# Altium schematic sheet mcu.SchDoc
size OrCAD B; DocumentNumber: 2; SheetNumber: 2; SheetTotal: 3
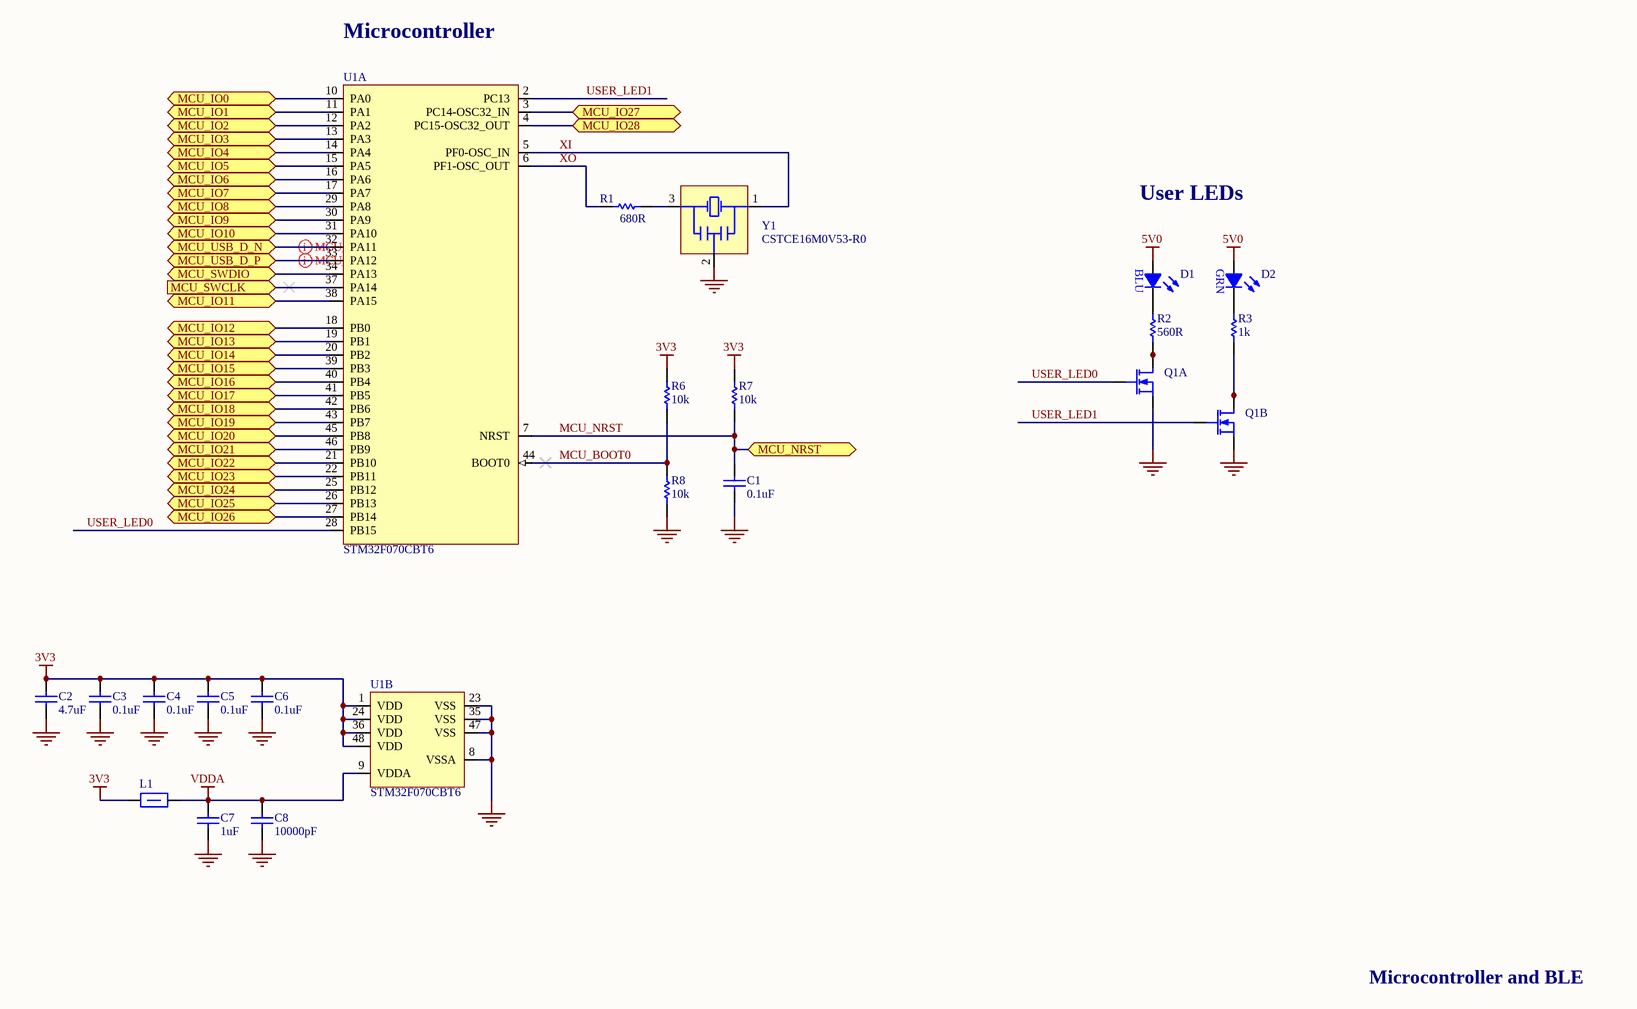
[diagram p0: mcu.SchDoc]

## Parts
C1  0.1uF  [C0201]
C2  4.7uF  [C0402]
C3  0.1uF  [C0201]
C4  0.1uF  [C0201]
C5  0.1uF  [C0201]
C6  0.1uF  [C0201]
C7  1uF  [C0402]
C8  10000pF  [C0201]
D1  5988091107F  [LED0603]  (value not drawn)
D2  5988070107F  [LED0603]  (value not drawn)
L1  BLM15AG601SN1D  [L0402]  (value not drawn)
Q1  PMDXB600UNE  [NXP_DFN1010B-6]  (value not drawn)  (parts A,B of 2)
R1  680R  [R0201]
R2  560R  [R0201]
R3  1k  [R0201]
R6  10k  [R0201]
R7  10k  [R0201]
R8  10k  [R0201]
U1  STM32F070CBT6  [STM_LQFP48]  (parts A,B of 2)
Y1  CSTCE16M0V53-R0  [MUR_CSTCE_V]

## Ports
MCU_IO0 (bidir), MCU_IO1 (bidir), MCU_IO2 (bidir), MCU_IO3 (bidir), MCU_IO4 (bidir), MCU_IO5 (bidir), MCU_IO6 (bidir), MCU_IO7 (bidir), MCU_IO8 (bidir), MCU_IO9 (bidir), MCU_IO10 (bidir), MCU_IO11 (bidir), MCU_IO12 (bidir), MCU_IO13 (bidir), MCU_IO14 (bidir), MCU_IO15 (bidir), MCU_IO16 (bidir), MCU_IO17 (bidir), MCU_IO18 (bidir), MCU_IO19 (bidir), MCU_IO20 (bidir), MCU_IO21 (bidir), MCU_IO22 (bidir), MCU_IO23 (bidir), MCU_IO24 (bidir), MCU_IO25 (bidir), MCU_IO26 (bidir), MCU_IO27 (bidir), MCU_IO28 (bidir), MCU_NRST (bidir), MCU_SWCLK (in), MCU_SWDIO (bidir), MCU_USB_D_N (bidir), MCU_USB_D_P (bidir)

## Nets
3V3: C2.2 C3.2 C4.2 C5.2 C6.2 L1.1 R6.2 R7.2 U1.1(VDD) U1.24(VDD) U1.36(VDD) U1.48(VDD)
5V0: D1.2(A) D2.2(A)
GND: C1.1 C2.1 C3.1 C4.1 C5.1 C6.1 C7.1 C8.1 Q1.1(S1) Q1.4(S2) R8.1 U1.8(VSSA) U1.23(VSS) U1.35(VSS) U1.47(VSS) Y1.2
VDDA: C7.2 C8.2 L1.2 U1.9(VDDA)
MCU_BOOT0: R6.1 R8.2 U1.44(BOOT0)
MCU_IO0: U1.10(PA0) ; port MCU_IO0
MCU_IO1: U1.11(PA1) ; port MCU_IO1
MCU_IO2: U1.12(PA2) ; port MCU_IO2
MCU_IO3: U1.13(PA3) ; port MCU_IO3
MCU_IO4: U1.14(PA4) ; port MCU_IO4
MCU_IO5: U1.15(PA5) ; port MCU_IO5
MCU_IO6: U1.16(PA6) ; port MCU_IO6
MCU_IO7: U1.17(PA7) ; port MCU_IO7
MCU_IO8: U1.29(PA8) ; port MCU_IO8
MCU_IO9: U1.30(PA9) ; port MCU_IO9
MCU_IO10: U1.31(PA10) ; port MCU_IO10
MCU_IO11: U1.38(PA15) ; port MCU_IO11
MCU_IO12: U1.18(PB0) ; port MCU_IO12
MCU_IO13: U1.19(PB1) ; port MCU_IO13
MCU_IO14: U1.20(PB2) ; port MCU_IO14
MCU_IO15: U1.39(PB3) ; port MCU_IO15
MCU_IO16: U1.40(PB4) ; port MCU_IO16
MCU_IO17: U1.41(PB5) ; port MCU_IO17
MCU_IO18: U1.42(PB6) ; port MCU_IO18
MCU_IO19: U1.43(PB7) ; port MCU_IO19
MCU_IO20: U1.45(PB8) ; port MCU_IO20
MCU_IO21: U1.46(PB9) ; port MCU_IO21
MCU_IO22: U1.21(PB10) ; port MCU_IO22
MCU_IO23: U1.22(PB11) ; port MCU_IO23
MCU_IO24: U1.25(PB12) ; port MCU_IO24
MCU_IO25: U1.26(PB13) ; port MCU_IO25
MCU_IO26: U1.27(PB14) ; port MCU_IO26
MCU_IO27: U1.3(PC14-OSC32_IN) ; port MCU_IO27
MCU_IO28: U1.4(PC15-OSC32_OUT) ; port MCU_IO28
MCU_NRST: C1.2 R7.1 U1.7(NRST) ; port MCU_NRST
MCU_SWCLK: U1.37(PA14) ; port MCU_SWCLK
MCU_SWDIO: U1.34(PA13) ; port MCU_SWDIO
MCU_USB_D_N: U1.32(PA11) ; port MCU_USB_D_N
MCU_USB_D_P: U1.33(PA12) ; port MCU_USB_D_P
USER_LED0: Q1.2(G1) U1.28(PB15)
USER_LED1: Q1.5(G2) U1.2(PC13)
XI: U1.5(PF0-OSC_IN) Y1.1
XO: R1.1 U1.6(PF1-OSC_OUT)
NetD1_1: D1.1(K) R2.2
NetD2_1: D2.1(K) R3.2
NetQ1_3: Q1.3(D2) Q1.8(D2) R3.1
NetQ1_6: Q1.6(D1) Q1.7(D1) R2.1
NetR1_2: R1.2 Y1.3

## Layout directives
differential pair: MCU_USB_D_N, MCU_USB_D_P

## Notes on the sheet
- Microcontroller
- User LEDs
- Microcontroller and BLE
- (in symbol Blue 0603 LED) BLU
- (in symbol Green 0603 LED) GRN

## Library data of the parts
C1 C3-C6 = 0.1uF 16V 0201: CAP CER 0.1UF 16V X5R 0201; Manufacturer: Murata; Manufacturer Part Number: GRM033R61C104ME84D; Capacitance: 1E-07f; Tolerance: 20%; Supplier 1: Digi-Key; Stock 1: 660567; Pricing 1: 1=0.1, 10=0.029, 100=0.013, 500=0.0093, 1000=0.0073, 2500=0.0067, 5000=0.0061 (USD); Case/Package: 0201; Weight: 1.2E-05oz; Case Code (Metric): 0603; Case Code (Imperial): 0201; Min Operating Temperature: -55°C; Max Operating Temperature: 85°C; Packaging: Tape and Reel; Voltage Rating: 16V; Dielectric: X5R; Termination: SMD/SMT; Voltage Rating (DC): 16V; Package Quantity: 15000; Length: 0.024inch; Height: 0.3mm; Width: 0.3mm; Thickness: 0.013inch; ComponentLink1URL: http://www.mouser.com/ds/2/281/c02e-2905.pdf; ComponentLink1Description: http://www.mouser.com/ds/2/281/c02e-2905.pdf; Supplier Part Number 1: 490-9986-1-ND
C2 = 4.7uF 16V 0402: CAP CER 4.7UF 16V X5R 0402; Manufacturer: Samsung; Manufacturer Part Number: CL05A475MO5NUNC; Tolerance: 20%; Supplier 1: Digi-Key; Stock 1: 282710; Pricing 1: 1=0.36, 10=0.248, 100=0.1485, 500=0.1114, 1000=0.0941, 2500=0.0891, 5000=0.0842 (USD); Case/Package: 0402; Case Code (Metric): 1005; Case Code (Imperial): 0402; Min Operating Temperature: -55°C; Max Operating Temperature: 85°C; Packaging: Tape and Reel; Capacitance: 4.7uF; Voltage Rating: 16V; Dielectric: X5R; Length: 0.039inch; Width: 0.02inch; Thickness: 0.022inch; Supplier Part Number 1: 1276-6836-1-ND
C7 = 1uF 25V 0402: CAP CER 1UF 25V X5R 0402; Manufacturer: Taiyo Yuden; Manufacturer Part Number: TMK105BJ105MV-F; Tolerance: 20%; Supplier 1: Digi-Key; Stock 1: 113342; Pricing 1: 1=0.2, 10=0.14, 100=0.066, 500=0.0463, 1000=0.0383, 2500=0.0357, 5000=0.0326 (USD); Mount: Surface Mount; Case/Package: 0402; Case Code (Metric): 1005; Case Code (Imperial): 0402; Min Operating Temperature: -55°C; Max Operating Temperature: 85°C; Packaging: Tape and Reel; Package Quantity: 1; Voltage Rating (DC): 25V; Dielectric: X5R; Termination: SMD/SMT; Capacitance: 1uF; Voltage Rating: 25V; Composition: Ceramic; Length: 1mm; Height: 0.5mm; Width: 0.02inch; Thickness: 0.022inch; Depth: 0.5mm; Radiation Hardening: No; Halogen Free: Halogen Free; ComponentLink1URL: https://datasheet.ciiva.com/11596/tmk105bj105mv-f-ss-11596466.pdf; ComponentLink1Description: https://datasheet.ciiva.com/11596/tmk105bj105mv-f-ss-11596466.pdf; ComponentLink2URL: https://datasheet.ciiva.com/15922/tmk105bj105mv-f-pdf-15922317.pdf; ComponentLink2Description: https://datasheet.ciiva.com/15922/tmk105bj105mv-f-pdf-15922317.pdf; ComponentLink3URL: https://datasheet.ciiva.com/13404/mlcc-all-e-541559-13404206.pdf; ComponentLink3Description: https://datasheet.ciiva.com/13404/mlcc-all-e-541559-13404206.pdf; ComponentLink4URL: https://datasheet.ciiva.com/30154/128tmk105bj105mv-f-30154639.pdf; ComponentLink4Description: https://datasheet.ciiva.com/30154/128tmk105bj105mv-f-30154639.pdf; Supplier Part Number 1: 587-3245-1-ND
C8 = 10000pF 25V 0201: CAP CER 10000PF 25V X5R 0201; Manufacturer: Murata; Manufacturer Part Number: GRM033R61E103MA12D; Capacitance: 10nF; Tolerance: 20%; Supplier 1: Digi-Key; Stock 1: 20535; Pricing 1: 1=0.1, 10=0.024, 100=0.0106, 500=0.00756, 1000=0.00595, 2500=0.00541, 5000=0.00497 (USD); Mount: Surface Mount; Case/Package: 0201; Case Code (Metric): 0603; Case Code (Imperial): 0201; Min Operating Temperature: -55°C; Max Operating Temperature: 85°C; Packaging: Tape and Reel; Voltage Rating: 25V; Voltage Rating (DC): 25V; Dielectric: X5R; Length: 0.024inch; Width: 0.012inch; Thickness: 0.013inch; ComponentLink1URL: http://search.murata.co.jp/Ceramy/image/img/A01X/partnumbering_e_01.pdf; ComponentLink1Description: http://search.murata.co.jp/Ceramy/image/img/A01X/partnumbering_e_01.pdf; Supplier Part Number 1: 490-9992-1-ND
D1 = Blue 0603 LED: LED BLUE CLEAR 0603 SMD; Manufacturer: Dialight; Manufacturer Part Number: 598-8091-107F; Lens Colour: Clear,Colorless; Wavelength: 475nm; Luminous Intensity: 140mcd; Viewing Angle: 140°; Forward Voltage: 3.2V; Lens Style: Clear,Diffused,Colorless,Rectangular; Forward Current: 20mA; Dominant Wavelength: 470nm; Number of Elements: 1; Power Dissipation: 70mW; Supplier 1: Digi-Key; Stock 1: 42042; Pricing 1: 1=0.75, 10=0.583, 25=0.4864, 100=0.4189, 250=0.374, 500=0.3216, 1000=0.2483 (USD); Mount: Surface Mount; Case/Package: 0603; Number of Pins: 2; Colour: Blue; Case Code (Metric): 1608; Case Code (Imperial): 0603; Min Operating Temperature: -30°C; Max Operating Temperature: 100°C; Packaging: Tape and Reel; Package Quantity: 4000; Illumination Colour: Blue; Lens Transparency: Clear; Test Current: 20mA; Number of LEDs: 1; Length: 1.6mm; Height: 0.7mm; Width: 0.8mm; Depth: 0.8mm; Radiation Hardening: No; REACH SVHC: No SVHC; Lead Free: Lead Free; ComponentLink1URL: https://datasheet.ciiva.com/15118/getdatasheetpartid-194139-15118048.pdf; ComponentLink1Description: https://datasheet.ciiva.com/15118/getdatasheetpartid-194139-15118048.pdf; ComponentLink2URL: https://datasheet.ciiva.com/2111/598-series-0603-pkg-2111556.pdf; ComponentLink2Description: https://datasheet.ciiva.com/2111/598-series-0603-pkg-2111556.pdf; ComponentLink3URL: https://datasheet.ciiva.com/2111/598-series-0603-pkg-2111557.pdf; ComponentLink3Description: https://datasheet.ciiva.com/2111/598-series-0603-pkg-2111557.pdf; ComponentLink4URL: https://datasheet.ciiva.com/15965/mdei5980603-15965445.pdf; ComponentLink4Description: https://datasheet.ciiva.com/15965/mdei5980603-15965445.pdf; ComponentLink5URL: https://datasheet.ciiva.com/30240/mdei5980603-30240533.pdf; ComponentLink5Description: https://datasheet.ciiva.com/30240/mdei5980603-30240533.pdf; ComponentLink6URL: https://datasheet.ciiva.com/2111/598-series-0603-pkg-2111558.pdf; ComponentLink6Description: https://datasheet.ciiva.com/2111/598-series-0603-pkg-2111558.pdf; ComponentLink7URL: https://datasheet.ciiva.com/7970/25658-7970182.pdf; ComponentLink7Description: https://datasheet.ciiva.com/7970/25658-7970182.pdf; ComponentLink8URL: https://datasheet.ciiva.com/14603/70081992-14603963.pdf; ComponentLink8Description: https://datasheet.ciiva.com/14603/70081992-14603963.pdf; ComponentLink9URL: https://datasheet.ciiva.com/16400/smt-selector-guide-16400478.pdf; ComponentLink9Description: https://datasheet.ciiva.com/16400/smt-selector-guide-16400478.pdf; Supplier Part Number 1: 350-2037-1-ND
D2 = Green 0603 LED: LED GREEN CLEAR 0603 SMD; Manufacturer: Dialight; Manufacturer Part Number: 598-8070-107F; Wavelength: 570nm; Luminous Intensity: 20mcd; Viewing Angle: 140°; Forward Voltage: 2V; Lens Style: Clear,Diffused,Colorless,Rectangular; Forward Current: 20mA; Dominant Wavelength: 568nm; Number of Elements: 1; Power Dissipation: 60mW; Supplier 1: Digi-Key; Stock 1: 147636; Pricing 1: 1=0.45, 10=0.327, 25=0.2504, 100=0.1634, 250=0.1198, 500=0.1016, 1000=0.0835 (USD); Mount: Surface Mount; Case/Package: 0603; Number of Pins: 2; Colour: Green; Case Code (Metric): 1608; Case Code (Imperial): 0603; Lens Colour: Clear; Min Operating Temperature: -30°C; Max Operating Temperature: 100°C; Packaging: Tape and Reel; Package Quantity: 4000; Illumination Colour: Green; Test Current: 20mA; Number of LEDs: 1; Length: 1.6mm; Height: 0.7mm; Width: 0.8mm; Depth: 0.8mm; Radiation Hardening: No; REACH SVHC: No SVHC; Lead Free: Lead Free; ComponentLink1URL: https://datasheet.ciiva.com/4688/598-selectorguide-18902-4688880.pdf; ComponentLink1Description: https://datasheet.ciiva.com/4688/598-selectorguide-18902-4688880.pdf; ComponentLink2URL: https://datasheet.ciiva.com/11774/0900766b80ae2975-11774257.pdf; ComponentLink2Description: https://datasheet.ciiva.com/11774/0900766b80ae2975-11774257.pdf; ComponentLink3URL: https://datasheet.ciiva.com/1243/1484480-1243893.pdf; ComponentLink3Description: https://datasheet.ciiva.com/1243/1484480-1243893.pdf; ComponentLink4URL: https://datasheet.ciiva.com/2110/598-series-0603-pkg-2110165.pdf; ComponentLink4Description: https://datasheet.ciiva.com/2110/598-series-0603-pkg-2110165.pdf; ComponentLink5URL: https://datasheet.ciiva.com/1243/1484480-1243894.pdf; ComponentLink5Description: https://datasheet.ciiva.com/1243/1484480-1243894.pdf; ComponentLink6URL: https://datasheet.ciiva.com/2110/598-series-0603-pkg-2110166.pdf; ComponentLink6Description: https://datasheet.ciiva.com/2110/598-series-0603-pkg-2110166.pdf; ComponentLink7URL: https://datasheet.ciiva.com/2110/598-series-0603-pkg-2110167.pdf; ComponentLink7Description: https://datasheet.ciiva.com/2110/598-series-0603-pkg-2110167.pdf; ComponentLink8URL: https://datasheet.ciiva.com/14605/70081990-14605530.pdf; ComponentLink8Description: https://datasheet.ciiva.com/14605/70081990-14605530.pdf; ComponentLink9URL: https://datasheet.ciiva.com/15965/mdei5980603-15965419.pdf; ComponentLink9Description: https://datasheet.ciiva.com/15965/mdei5980603-15965419.pdf; ComponentLink10URL: https://datasheet.ciiva.com/30188/mdei5980603-30188139.pdf; ComponentLink10Description: https://datasheet.ciiva.com/30188/mdei5980603-30188139.pdf; ComponentLink11URL: https://datasheet.ciiva.com/15117/getdatasheetpartid-146438-15117836.pdf; ComponentLink11Description: https://datasheet.ciiva.com/15117/getdatasheetpartid-146438-15117836.pdf; ComponentLink12URL: https://datasheet.ciiva.com/22749/1484480-22749228.pdf; ComponentLink12Description: https://datasheet.ciiva.com/22749/1484480-22749228.pdf; ComponentLink13URL: https://datasheet.ciiva.com/16400/smt-selector-guide-16400463.pdf; ComponentLink13Description: https://datasheet.ciiva.com/16400/smt-selector-guide-16400463.pdf; Supplier Part Number 1: 350-2035-1-ND
L1 = BLM15AG601SN1D: FERRITE BEAD 600 OHM 0402 1LN; Manufacturer: Murata; Material: Steel,Ferrite; Impedance: 600R; Tolerance: 25%; Max DC Current: 300mA; DC Resistance (DCR): 520mR; Test Frequency: 100MHz; Number of Lines: 1; Shielding: Unshielded; Supplier 1: Digi-Key; Manufacturer Part Number: BLM15AG601SN1D; Stock 1: 1368913; Pricing 1: 1=0.1, 10=0.069, 25=0.0628, 50=0.0564, 100=0.0414, 250=0.03008, 500=0.02758, 1000=0.02383, 5000=0.01881 (USD); Case/Package: 0402; Number of Pins: 2; Core Material: Ferrite; Case Code (Metric): 1005; Case Code (Imperial): 0402; Min Operating Temperature: -55°C; Max Operating Temperature: 125°C; Package Quantity: 10000; Packaging: Tape and Reel; Current Rating: 300mA; Max Current Rating: 300mA; Termination: SMD/SMT; DC Current: 300mA; Military Standard: Not; Frequency: 100MHz; Number of Circuits: 1; Length: 1mm; Height: 0.5mm; Width: 0.5mm; Depth: 0.55mm; Radiation Hardening: No; REACH SVHC: No SVHC; Lead Free: Lead Free; ComponentLink1URL: https://datasheet.ciiva.com/6212/l0110s0100blm15ag-sn-6212565.pdf; ComponentLink1Description: https://datasheet.ciiva.com/6212/l0110s0100blm15ag-sn-6212565.pdf; ComponentLink2URL: https://datasheet.ciiva.com/6212/l0110s0100blm15ag-sn-6212519.pdf; ComponentLink2Description: https://datasheet.ciiva.com/6212/l0110s0100blm15ag-sn-6212519.pdf; ComponentLink3URL: https://datasheet.ciiva.com/1466/5144-1466744.pdf; ComponentLink3Description: https://datasheet.ciiva.com/1466/5144-1466744.pdf; ComponentLink4URL: https://datasheet.ciiva.com/6212/l0110s0100blm15ag-sn-6212520.pdf; ComponentLink4Description: https://datasheet.ciiva.com/6212/l0110s0100blm15ag-sn-6212520.pdf; ComponentLink5URL: https://datasheet.ciiva.com/1466/5144-1466745.pdf; ComponentLink5Description: https://datasheet.ciiva.com/1466/5144-1466745.pdf; ComponentLink6URL: https://datasheet.ciiva.com/11799/0900766b811b5866-11799226.pdf; ComponentLink6Description: https://datasheet.ciiva.com/11799/0900766b811b5866-11799226.pdf; ComponentLink7URL: https://datasheet.ciiva.com/8510/l0110s0100blm15ag-sn-8510909.pdf; ComponentLink7Description: https://datasheet.ciiva.com/8510/l0110s0100blm15ag-sn-8510909.pdf; ComponentLink8URL: https://datasheet.ciiva.com/14122/blm-series-eng-tds-14122894.pdf; ComponentLink8Description: https://datasheet.ciiva.com/14122/blm-series-eng-tds-14122894.pdf; ComponentLink9URL: https://datasheet.ciiva.com/8084/l0110s0100blm15ag-sn-8084271.pdf; ComponentLink9Description: https://datasheet.ciiva.com/8084/l0110s0100blm15ag-sn-8084271.pdf; ComponentLink10URL: https://datasheet.ciiva.com/29347/442210-da-01-en-chip-drossel-0402-600r-300ma-1-0x0-5mm-29347879.pdf; ComponentLink10Description: https://datasheet.ciiva.com/29347/442210-da-01-en-chip-drossel-0402-600r-300ma-1-0x0-5mm-29347879.pdf; ComponentLink11URL: https://datasheet.ciiva.com/41449/001172163-da-01-en-drossel-0402-600r-1-0x0-5mm-10000st-41449450.pdf; ComponentLink11Description: https://datasheet.ciiva.com/41449/001172163-da-01-en-drossel-0402-600r-1-0x0-5mm-10000st-41449450.pdf; Supplier Part Number 1: 490-1006-1-ND
Q1 = PMDXB600UNE: MOSFET 2N-CH 20V 0.6A 6DFN; Manufacturer: NXP Semiconductors; Rds On Max: 620mR; Input Capacitance: 21.3pF; Continuous Drain Current (ID): 600mA; Max Power Dissipation: 265mW; Threshold Voltage: 700mV; Level: 1; Supplier 1: Digi-Key; Manufacturer Part Number: PMDXB600UNE; Stock 1: 27879; Pricing 1: 1=0.65, 10=0.552, 100=0.4124, 500=0.324, 1000=0.2504 (USD); Case/Package: 600; Number of Pins: 6; Min Operating Temperature: -55°C; Max Operating Temperature: 150°C; Packaging: Tape and Reel; Drain to Source Voltage (Vdss): 20V; REACH SVHC: No SVHC; ComponentLink1URL: https://datasheet.ciiva.com/29589/pmdxb600une-29589931.pdf; ComponentLink1Description: https://datasheet.ciiva.com/29589/pmdxb600une-29589931.pdf; ComponentLink2URL: https://datasheet.ciiva.com/29589/pmdxb600une-29589932.pdf; ComponentLink2Description: https://datasheet.ciiva.com/29589/pmdxb600une-29589932.pdf; ComponentLink3URL: https://datasheet.ciiva.com/29589/pmdxb600une-29589933.pdf; ComponentLink3Description: https://datasheet.ciiva.com/29589/pmdxb600une-29589933.pdf; Supplier Part Number 1: 1727-1470-1-ND
R1 = 680R 0201: RES SMD 680 OHM 1% 1/20W 0201; Manufacturer: Yageo; Manufacturer Part Number: RC0201FR-07680RL; Power Rating: 50mW; Voltage Rating: 25V; Temperature Coefficient: 200ppm/°C; Supplier 1: Digi-Key; Stock 1: 13371; Pricing 1: 1=0.1, 10=0.046, 100=0.0187, 1000=0.00841, 2500=0.0073, 5000=0.00603 (USD); Case/Package: 0201; Case Code (Imperial): 0201; Case Code (Metric): 0603; Min Operating Temperature: -55°C; Max Operating Temperature: 125°C; Resistance: 680R; Tolerance: 1%; Packaging: Tape and Reel; Composition: Thick Film; Number of Terminations: 2; Termination: SMD/SMT; Military Standard: Not; Max Power Dissipation: 50mW; Length: 0.6mm; Height: 0.01inch; Width: 0.012inch; Depth: 0.3mm; REACH SVHC: No SVHC; Lead Free: Lead Free; ComponentLink1URL: https://datasheet.ciiva.com/7672/1563626-7672238.pdf; ComponentLink1Description: https://datasheet.ciiva.com/7672/1563626-7672238.pdf; Supplier Part Number 1: YAG2769CT-ND
R2 = 560R 0201: RES SMD 560 OHM 1% 1/20W 0201; Manufacturer: Panasonic ECG; Manufacturer Part Number: ERJ-1GEF5600C; Power Rating: 50mW; Voltage Rating: 25V; Temperature Coefficient: 200ppm/°C; Voltage Rating (DC): 15V; Supplier 1: Digi-Key; Stock 1: 11988; Pricing 1: 1=0.1, 10=0.059, 100=0.024, 1000=0.0108, 2500=0.0094, 5000=0.0077 (USD); Mount: Surface Mount; Case/Package: 0201; Case Code (Imperial): 0201; Case Code (Metric): 0603; Contact Plating: Tin; Min Operating Temperature: -55°C; Max Operating Temperature: 125°C; Packaging: Tape and Reel; Resistance: 560R; Tolerance: 1%; Package Quantity: 15000; Composition: Thick Film; Number of Terminations: 2; Military Standard: Not; Max Power Dissipation: 50mW; Length: 0.6mm; Height: 0.01inch; Width: 0.3mm; Depth: 0.3mm; Radiation Hardening: No; Lead Free: Lead Free; ComponentLink1URL: https://datasheet.ciiva.com/2440/erj-g-r-e-rev08-2440588.pdf; ComponentLink1Description: https://datasheet.ciiva.com/2440/erj-g-r-e-rev08-2440588.pdf; ComponentLink2URL: https://datasheet.ciiva.com/2440/erj-g-r-e-rev08-2440589.pdf; ComponentLink2Description: https://datasheet.ciiva.com/2440/erj-g-r-e-rev08-2440589.pdf; ComponentLink3URL: https://datasheet.ciiva.com/2440/erj-g-r-e-rev08-2440590.pdf; ComponentLink3Description: https://datasheet.ciiva.com/2440/erj-g-r-e-rev08-2440590.pdf; Supplier Part Number 1: P560ABCT-ND
R3 = 1k 0201: RES SMD 1K OHM 1% 1/20W 0201; Manufacturer: Panasonic ECG; Manufacturer Part Number: ERJ-1GEF1001C; Resistance: 1KR; Power Rating: 50mW; Voltage Rating: 25V; Temperature Coefficient: 200ppm/°C; Voltage Rating (DC): 15V; Supplier 1: Digi-Key; Stock 1: 3138057; Pricing 1: 1=0.1, 10=0.059, 100=0.024, 1000=0.0108, 2500=0.0094, 5000=0.0077 (USD); Mount: Surface Mount; Case/Package: 0201; Case Code (Metric): 0603; Case Code (Imperial): 0201; Contact Plating: Tin; Min Operating Temperature: -55°C; Max Operating Temperature: 125°C; Packaging: Tape and Reel; Tolerance: 1%; Package Quantity: 15000; Composition: Thick Film; Number of Terminations: 2; Termination: SMD/SMT; Military Standard: Not; Max Power Dissipation: 50mW; Length: 0.6mm; Height: 0.23mm; Width: 0.012inch; Depth: 0.3mm; Radiation Hardening: No; REACH SVHC: Unknown; Lead Free: Lead Free; ComponentLink1URL: https://datasheet.ciiva.com/28532/1694929-28532042.pdf; ComponentLink1Description: https://datasheet.ciiva.com/28532/1694929-28532042.pdf; ComponentLink2URL: https://datasheet.ciiva.com/16763/70260683-16763516.pdf; ComponentLink2Description: https://datasheet.ciiva.com/16763/70260683-16763516.pdf; ComponentLink3URL: https://datasheet.ciiva.com/16199/erj-1gef1001c-16199565.pdf; ComponentLink3Description: https://datasheet.ciiva.com/16199/erj-1gef1001c-16199565.pdf; ComponentLink4URL: https://datasheet.ciiva.com/30155/aoa0000ce2-30155870.pdf; ComponentLink4Description: https://datasheet.ciiva.com/30155/aoa0000ce2-30155870.pdf; ComponentLink5URL: https://datasheet.ciiva.com/7942/1678796-7942463.pdf; ComponentLink5Description: https://datasheet.ciiva.com/7942/1678796-7942463.pdf; ComponentLink6URL: https://datasheet.ciiva.com/16782/70260683-16782463.pdf; ComponentLink6Description: https://datasheet.ciiva.com/16782/70260683-16782463.pdf; Supplier Part Number 1: P1.00KABCT-ND
R6-R8 = 10k 0201: RES SMD 10K OHM 1% 1/20W 0201; Manufacturer: Panasonic ECG; Manufacturer Part Number: ERJ-1GEF1002C; Resistance: 10KR; Power Rating: 50mW; Voltage Rating: 25V; Temperature Coefficient: 200ppm/°C; Voltage Rating (DC): 15V; Supplier 1: Digi-Key; Stock 1: 4709989; Pricing 1: 1=0.1, 10=0.059, 100=0.024, 1000=0.0108, 2500=0.0094, 5000=0.0077 (USD); Mount: Surface Mount; Case/Package: 0201; Case Code (Metric): 0603; Case Code (Imperial): 0201; Contact Plating: Tin; Min Operating Temperature: -55°C; Max Operating Temperature: 125°C; Tolerance: 1%; Packaging: Tape and Reel; Package Quantity: 15000; Composition: Thick Film; Number of Terminations: 2; Termination: SMD/SMT; Military Standard: Not; Max Power Dissipation: 50mW; Length: 0.6mm; Height: 0.23mm; Width: 0.012inch; Depth: 0.3mm; Radiation Hardening: No; REACH SVHC: Unknown; Lead Free: Lead Free; ComponentLink1URL: https://datasheet.ciiva.com/16427/erj-1gef1002c-16427252.pdf; ComponentLink1Description: https://datasheet.ciiva.com/16427/erj-1gef1002c-16427252.pdf; ComponentLink2URL: https://datasheet.ciiva.com/30111/aoa0000ce2-30111653.pdf; ComponentLink2Description: https://datasheet.ciiva.com/30111/aoa0000ce2-30111653.pdf; ComponentLink3URL: https://datasheet.ciiva.com/16775/70260683-16775527.pdf; ComponentLink3Description: https://datasheet.ciiva.com/16775/70260683-16775527.pdf; ComponentLink4URL: https://datasheet.ciiva.com/22785/1678796-22785991.pdf; ComponentLink4Description: https://datasheet.ciiva.com/22785/1678796-22785991.pdf; ComponentLink5URL: https://datasheet.ciiva.com/7830/1678796-7830952.pdf; ComponentLink5Description: https://datasheet.ciiva.com/7830/1678796-7830952.pdf; ComponentLink6URL: https://datasheet.ciiva.com/16770/70260683-16770095.pdf; ComponentLink6Description: https://datasheet.ciiva.com/16770/70260683-16770095.pdf; Supplier Part Number 1: P10.0KABCT-ND
U1 = STM32F070CBT6: IC MCU 32BIT 128KB FLASH 48LQFP; Manufacturer: STMicroelectronics; Interface: I2C,SPI,USB,UART,USART; Number of I/Os: 37; Frequency: 48MHz; Oscillator Type: Internal; Peripherals: POR,PWM,WDT,DMA; Core Architecture: ARM; RAM Size: 16KB; Max Power Dissipation: 364mW; Data Bus Width: 32b; Number of Timers/Counters: 8; Watchdog Timer: Yes; Number of ADC Channels: 1; Max Supply Voltage: 3.6V; Min Supply Voltage: 2.4V; Operating Supply Voltage: 3.3V; Supplier 1: Digi-Key; Manufacturer Part Number: STM32F070CBT6; Stock 1: 10286; Pricing 1: 1=2.52, 10=2.268, 100=1.8231, 500=1.49782, 1000=1.24106 (USD); Mount: Surface Mount; Case/Package: LQFP; Number of Pins: 48; Weight: 0.006409oz; Min Operating Temperature: -40°C; Max Operating Temperature: 85°C; Packaging: Tray; Memory Type: FLASH; Memory Size: 128KB; Number of Programmable I/O: 37; Max Frequency: 48MHz; Package Quantity: 250; Lead Free: Lead Free; ComponentLink1URL: http://www.farnell.com/datasheets/2281751.pdf; ComponentLink1Description: http://www.farnell.com/datasheets/2281751.pdf; ComponentLink2URL: http://www.st.com/st-web-ui/static/active/en/resource/technical/document/datasheet/DM00141386.pdf; ComponentLink2Description: http://www.st.com/st-web-ui/static/active/en/resource/technical/document/datasheet/DM00141386.pdf; ComponentLink3URL: http://www.st.com/content/ccc/resource/technical/document/datasheet/31/4f/10/5f/a5/32/46/42/DM00141386.pdf/files/DM00141386.pdf/jcr:content/translations/en.DM00141386.pdf; ComponentLink3Description: http://www.st.com/content/ccc/resource/technical/document/datasheet/31/4f/10/5f/a5/32/46/42/DM00141386.pdf/files/DM00141386.pdf/jcr:content/translations/en.DM00141386.pdf; ComponentLink4URL: http://www.mouser.com/ds/2/389/stm32f070c6-956182.pdf; ComponentLink4Description: http://www.mouser.com/ds/2/389/stm32f070c6-956182.pdf; Supplier Part Number 1: 497-15099-ND
Y1 = 16MHz Resonator: CER RES 16.0000MHZ 15PF SMD; Manufacturer: Murata; Frequency: 16MHz; Frequency Tolerance: 0.5%; Impedance: 40R; Frequency Stability: 0.3%; Supplier 1: Digi-Key; Manufacturer Part Number: CSTCE16M0V53-R0; Stock 1: 104178; Pricing 1: 1=0.5, 10=0.42, 50=0.3776, 100=0.3357, 500=0.3189, 1000=0.2686 (USD); Case/Package: SMD/SMT; Number of Pins: 3; Contact Plating: Gold; Min Operating Temperature: -20°C; Max Operating Temperature: 80°C; Self Resonant Frequency: 16MHz; Load Capacitance: 15pF; Tolerance: 0.5%; Package Quantity: 3000; Capacitance: 15pF; Packaging: Tape and Reel; Termination: SMD/SMT; Composition: Ceramic; Length: 0.126inch; Height: 0.039inch; Width: 0.051inch; REACH SVHC: No SVHC; Lead Free: Lead Free; ComponentLink1URL: https://datasheet.ciiva.com/18183/getdatasheetpartid-152969-18183272.pdf; ComponentLink1Description: https://datasheet.ciiva.com/18183/getdatasheetpartid-152969-18183272.pdf; ComponentLink2URL: https://datasheet.ciiva.com/884/p16e-884477.pdf; ComponentLink2Description: https://datasheet.ciiva.com/884/p16e-884477.pdf; ComponentLink3URL: https://datasheet.ciiva.com/1361/1506176-1361293.pdf; ComponentLink3Description: https://datasheet.ciiva.com/1361/1506176-1361293.pdf; ComponentLink4URL: https://datasheet.ciiva.com/884/p16e-884478.pdf; ComponentLink4Description: https://datasheet.ciiva.com/884/p16e-884478.pdf; ComponentLink5URL: https://datasheet.ciiva.com/884/p16e-884479.pdf; ComponentLink5Description: https://datasheet.ciiva.com/884/p16e-884479.pdf; ComponentLink6URL: https://datasheet.ciiva.com/14132/ceralock-eng-bro-14132735.pdf; ComponentLink6Description: https://datasheet.ciiva.com/14132/ceralock-eng-bro-14132735.pdf; ComponentLink7URL: https://datasheet.ciiva.com/16216/l0430e-16216847.pdf; ComponentLink7Description: https://datasheet.ciiva.com/16216/l0430e-16216847.pdf; Supplier Part Number 1: 490-1198-1-ND